# Altium project kitesp32_smartgarden.PrjPcb
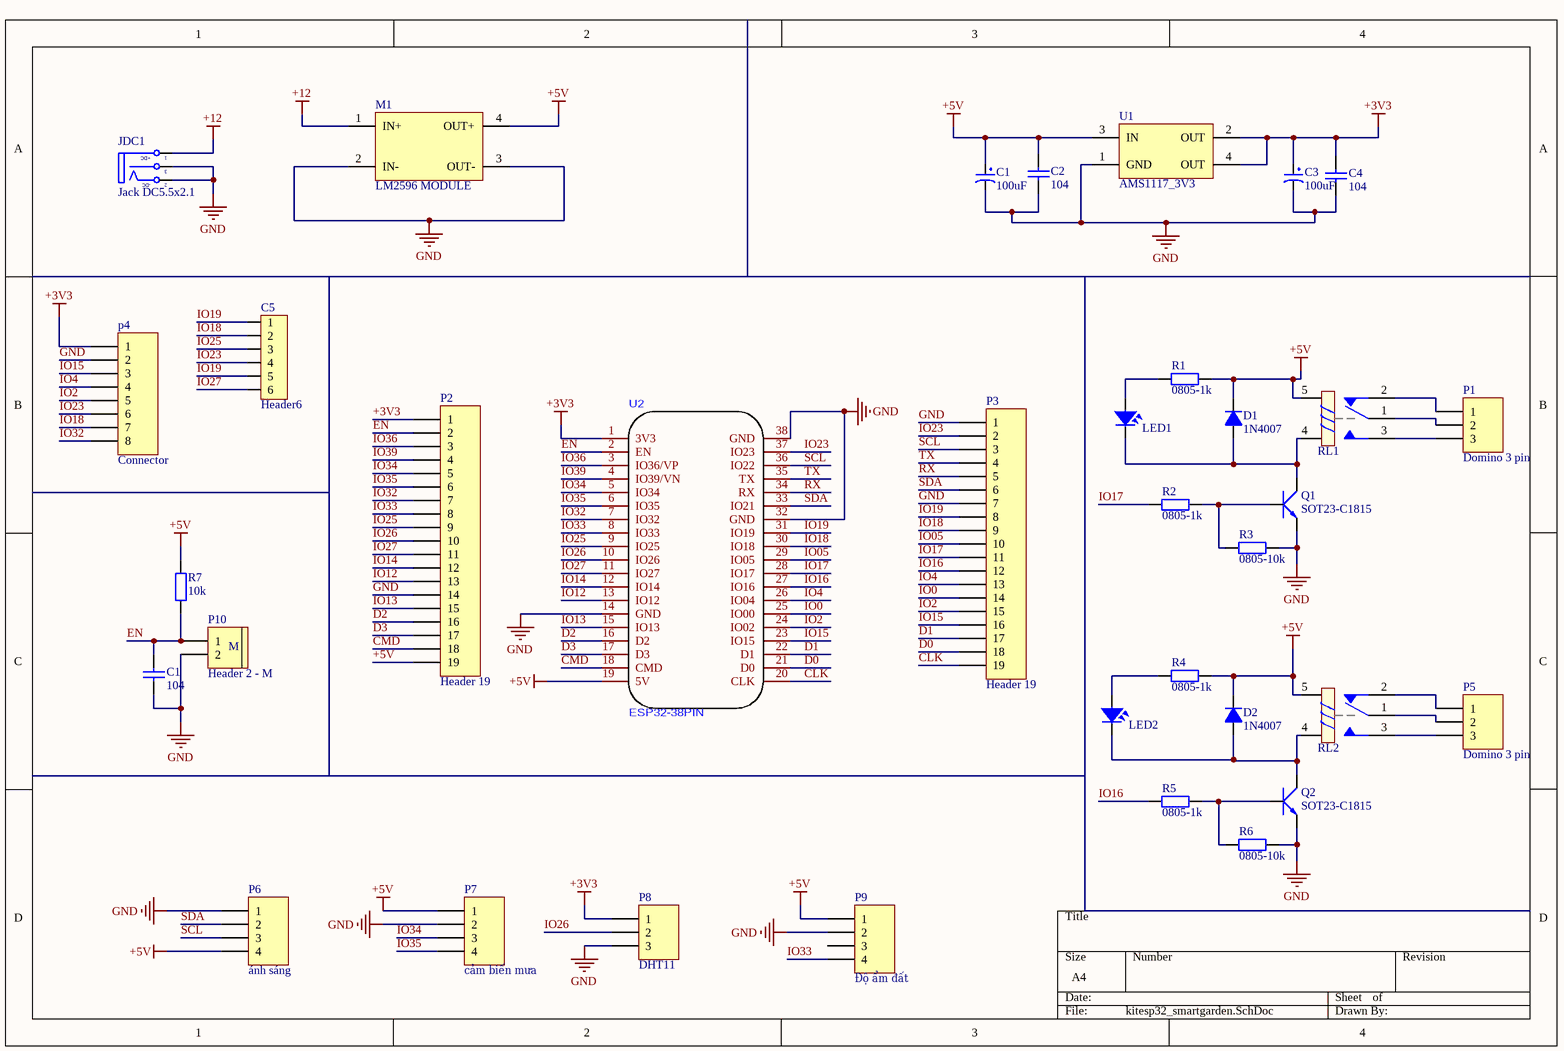
[diagram p0: kitesp32_smartgarden.SchDoc]
1 sheet, 35 parts. Net scope: global (net labels, ports and power ports of the same name join across sheets).
Board file: kitesp32_smartgarden.PcbDoc

## Sheet kitesp32_smartgarden.SchDoc
size A4; SheetNumber: 1; SheetTotal: 1

### Parts
(Parts that share a designator on the sheet are numbered #1, #2 ... from top to bottom, then left to right.)
C1#1  100uF  [tu hoa 8mm]
C1#2  104  [CN1.5]
C2  104  [0805]
C3  100uF  [tu hoa 8mm]
C4  104  [0805]
C5  Header6  [HDR6]
D1  1N4007  [D1A]
D2  1N4007  [D1A]
JDC1  Jack DC5.5x2.1  [DC-IN]
LED1  LED  [LED-0805-Orange]  (value not drawn)
LED2  LED  [LED-0805-Orange]  (value not drawn)
M1  LM2596 MODULE  [LM2596_MODULE]
P1  Domino 3 pin  [DOMINO_3PIN_5.08MM_RUT]
P2  Header 19  [HDR1X19]
P3  Header 19  [HDR1X19]
p4  Connector  [JST-XH_B8B-XH-A]
P5  Domino 3 pin  [DOMINO_3PIN_5.08MM_RUT]
P6  ánh sáng  [DOMINO_4PIN_5.08MM_RUT]
P7  cảm biến mưa  [DOMINO_4PIN_5.08MM_RUT]
P8  DHT11  [DOMINO_3PIN_5.08MM_RUT]
P9  Độ ẩm đất  [DOMINO_4PIN_5.08MM_RUT]
P10  Header 2 - M  [Medium - Header 2]
Q1  SOT23-C1815  [SOT23B]
Q2  SOT23-C1815  [SOT23B]
R1  value 0805-1k  [DIEN TRO 0805]  (hidden comment: R0805)
R2  value 0805-1k  [DIEN TRO 0805]  (hidden comment: R0805)
R3  value 0805-10k  [DIEN TRO 0805]  (hidden comment: R0805)
R4  value 0805-1k  [DIEN TRO 0805]  (hidden comment: R0805)
R5  value 0805-1k  [DIEN TRO 0805]  (hidden comment: R0805)
R6  value 0805-10k  [DIEN TRO 0805]  (hidden comment: R0805)
R7  10k  [R1/4W]
RL1  MH  [RELAY5PIN-10A]  (value not drawn)
RL2  MH  [RELAY5PIN-10A]  (value not drawn)
U1  AMS1117_3V3  [SOT223-4M]
U2  ESP32-38PIN  [ESP32-38PIN]

### Nets
+3V3: C3.1 C4.2 P2.1 p4.1 P8.1 U1.2(OUT) U1.4(OUT) U2.1(3V3)
+5V: C1#1.1 C2.2 D1.2(K) D2.2(K) M1.4(OUT+) P2.19 P6.4 P7.1 P9.1 R1.2 R4.2 R7.2 RL1.5 RL2.5 U1.3(IN) U2.19(5V)
+12: JDC1.1(T) M1.1(IN+)
GND: C1#1.2 C1#2.1 C2.1 C3.2 C4.1 JDC1.2(TN) JDC1.3(S) M1.2(IN-) M1.3(OUT-) P2.14 P3.1 P3.7 p4.2 P6.1 P7.2 P8.3 P9.2 P10.2 Q1.3(E) Q2.3(E) R3.2 R6.2 U1.1(GND) U2.14(GND) U2.32(GND) U2.38(GND)
CLK: P3.19 U2.20(CLK)
CMD: P2.18 U2.18(CMD)
D0: P3.18 U2.21(D0)
D1: P3.17 U2.22(D1)
D2: P2.16 U2.16(D2)
D3: P2.17 U2.17(D3)
EN: C1#2.2 P2.2 P10.1 R7.1 U2.2(EN)
IO0: P3.14 U2.25(IO00)
IO2: P3.15 p4.5 U2.24(IO02)
IO4: P3.13 p4.4 U2.26(IO04)
IO05: P3.10 U2.29(IO05)
IO12: P2.13 U2.13(IO12)
IO13: P2.15 U2.15(IO13)
IO14: P2.12 U2.12(IO14)
IO15: P3.16 p4.3 U2.23(IO15)
IO16: P3.12 R5.1 U2.27(IO16)
IO17: P3.11 R2.1 U2.28(IO17)
IO18: C5.2 P3.9 p4.7 U2.30(IO18)
IO19: C5.1 C5.5 P3.8 U2.31(IO19)
IO23: C5.4 P3.2 p4.6 U2.37(IO23)
IO25: C5.3 P2.9 U2.9(IO25)
IO26: P2.10 P8.2 U2.10(IO26)
IO27: C5.6 P2.11 U2.11(IO27)
IO32: P2.7 p4.8 U2.7(IO32)
IO33: P2.8 P9.4 U2.8(IO33)
IO34: P2.5 P7.3 U2.5(IO34)
IO35: P2.6 P7.4 U2.6(IO35)
IO36: P2.3 U2.3(IO36/VP)
IO39: P2.4 U2.4(IO39/VN)
RX: P3.5 U2.34(RX)
SCL: P3.3 P6.3 U2.36(IO22)
SDA: P3.6 P6.2 U2.33(IO21)
TX: P3.4 U2.35(TX)
NetD1_1: D1.1(A) LED1.2 Q1.2(C) RL1.4
NetD2_1: D2.1(A) LED2.2 Q2.2(C) RL2.4
NetLED1_1: LED1.1 R1.1
NetLED2_1: LED2.1 R4.1
NetP1_1: P1.1 RL1.2
NetP1_2: P1.2 RL1.1
NetP1_3: P1.3 RL1.3
NetP5_1: P5.1 RL2.2
NetP5_2: P5.2 RL2.1
NetP5_3: P5.3 RL2.3
NetQ1_1: Q1.1(B) R2.2 R3.1
NetQ2_1: Q2.1(B) R5.2 R6.1

Not connected (* = marked no-connect by the designer): P9 3

### Notes on the sheet
- (in symbol Header 2 - M) M
- (in symbol Jac_DC) +DC; -DC

### Library data of the parts
C1#1 C3 = Tu Hoa 100uF 50V 8x11: Cắm; Don_Vi: Con; So_Chan: 2; Ten_Linh_Kien: Tụ Hóa 100uF 50V 8x11MM; Ma_Hang: MH006872; Chung_Loai: Cắm; Kieu_Chan: *
C1#2 = Cap 104: Capacitor (Semiconductor SIM Model); Value: 0.1uF; Published: 8-Jun-2000; LatestRevisionDate: 17-Jul-2002; LatestRevisionNote: Re-released for DXP Platform.; PackageReference: C1206; Publisher: Altium Limited
C2 C4 = Cap 104_SMD: Capacitor (Semiconductor SIM Model); Value: 0.1uF; Published: 8-Jun-2000; LatestRevisionDate: 17-Jul-2002; LatestRevisionNote: Re-released for DXP Platform.; PackageReference: C1206; Publisher: Altium Limited
C5 = Header6: Header IDC, 6 x 1 Pin Vertical 2.54mm Pitch (Non-Boxed, Male); Manufacturer: W¨¹rth Elektronik eiSos GmbH; partNo: 613002143121; ComponentLink1 Description: Manufacturer; ComponentLink2 Description: Datasheet; NoPins: 02; Created Date: 29 March 2013; ComponentLink1URL: http://www.we-online.com; ComponentLink2URL: http://katalog.we-online.de/em/datasheet/6130xx143121.pdf; Created by: Karrer Zheng
D1 D2 = Diode 1A: Value: 1N4007
JDC1 = Jac_DC: Cắm; Ten_Linh_Kien: Jack DC5.5x2.1MM DC5501; Ma_Hang: MH000923; Don_Vi: Con; Kieu_Chan: *; Ghi_Chu: *; Chung_Loai: Cắm
LED1 LED2 = LED SMD: Value: LED 3 - 5 ly 2 Colour
M1 = LM2596_MODULE
P2 P3 = Header 19: Header, 19-Pin; LatestRevisionDate: 17-Jul-2002; LatestRevisionNote: Re-released for DXP Platform.; Publisher: Altium Limited
p4 = Connector_8pin
P6 P7 P9 = Domino 4 pin
P8 = Domino 3 pin
P10 = Header 2 - M: Header, 2-Pin, Medium; LatestRevisionDate: 17-Jul-2002; LatestRevisionNote: Re-released for DXP Platform.; Publisher: Altium Limited
Q1 Q2 = C1815: Dán; Ten_Linh_Kien: C1815 SOT23 TRANS NPN 0.15A 50V (SMD-HF); Don_Vi: Con; Ma_Hang: MH000946; Ghi_Chu: *; Kieu_Chan: *; Chung_Loai: Dán
R1-R6 = R0805: Resistor SMD 0805; Published: 8-Jun-2000; LatestRevisionDate: 17-Jul-2002; LatestRevisionNote: Re-released for DXP Platform.; PackageReference: AXIAL-0.4; Publisher: Altium Limited
R7 = R1/4W: Resistor 1/4W; Value: R1/4W - 1K
RL1 RL2 = Relay 10A: Cắm; Value: Relay ?V - 10A
U1 = AMS1117_3V3: 1A Regulator